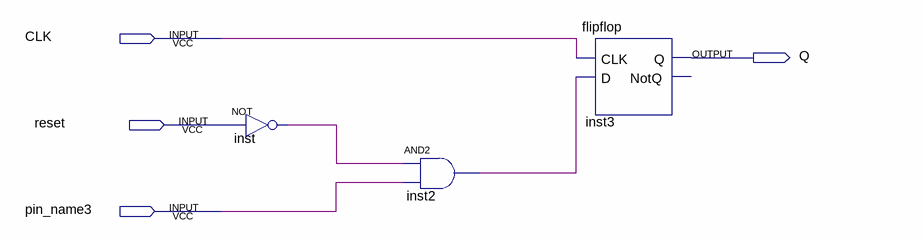
[diagram p0: schematic sheet]
// Quartus schematic resetableflipflop.bdf as structural Verilog: 3 symbols, 4 pins
module resetableflipflop (
  input  CLK,
  input  reset,
  input  pin_name3,
  output Q
);

  wire inst2_out, inst_out;

  not inst (inst_out, reset);
  and inst2 (inst2_out, inst_out, pin_name3);
  flipflop inst3 (.CLK(CLK), .D(inst2_out), .Q(Q));  // open: NotQ
endmodule
